# Altium project dory-x.PrjPcb (part 5 of 12)
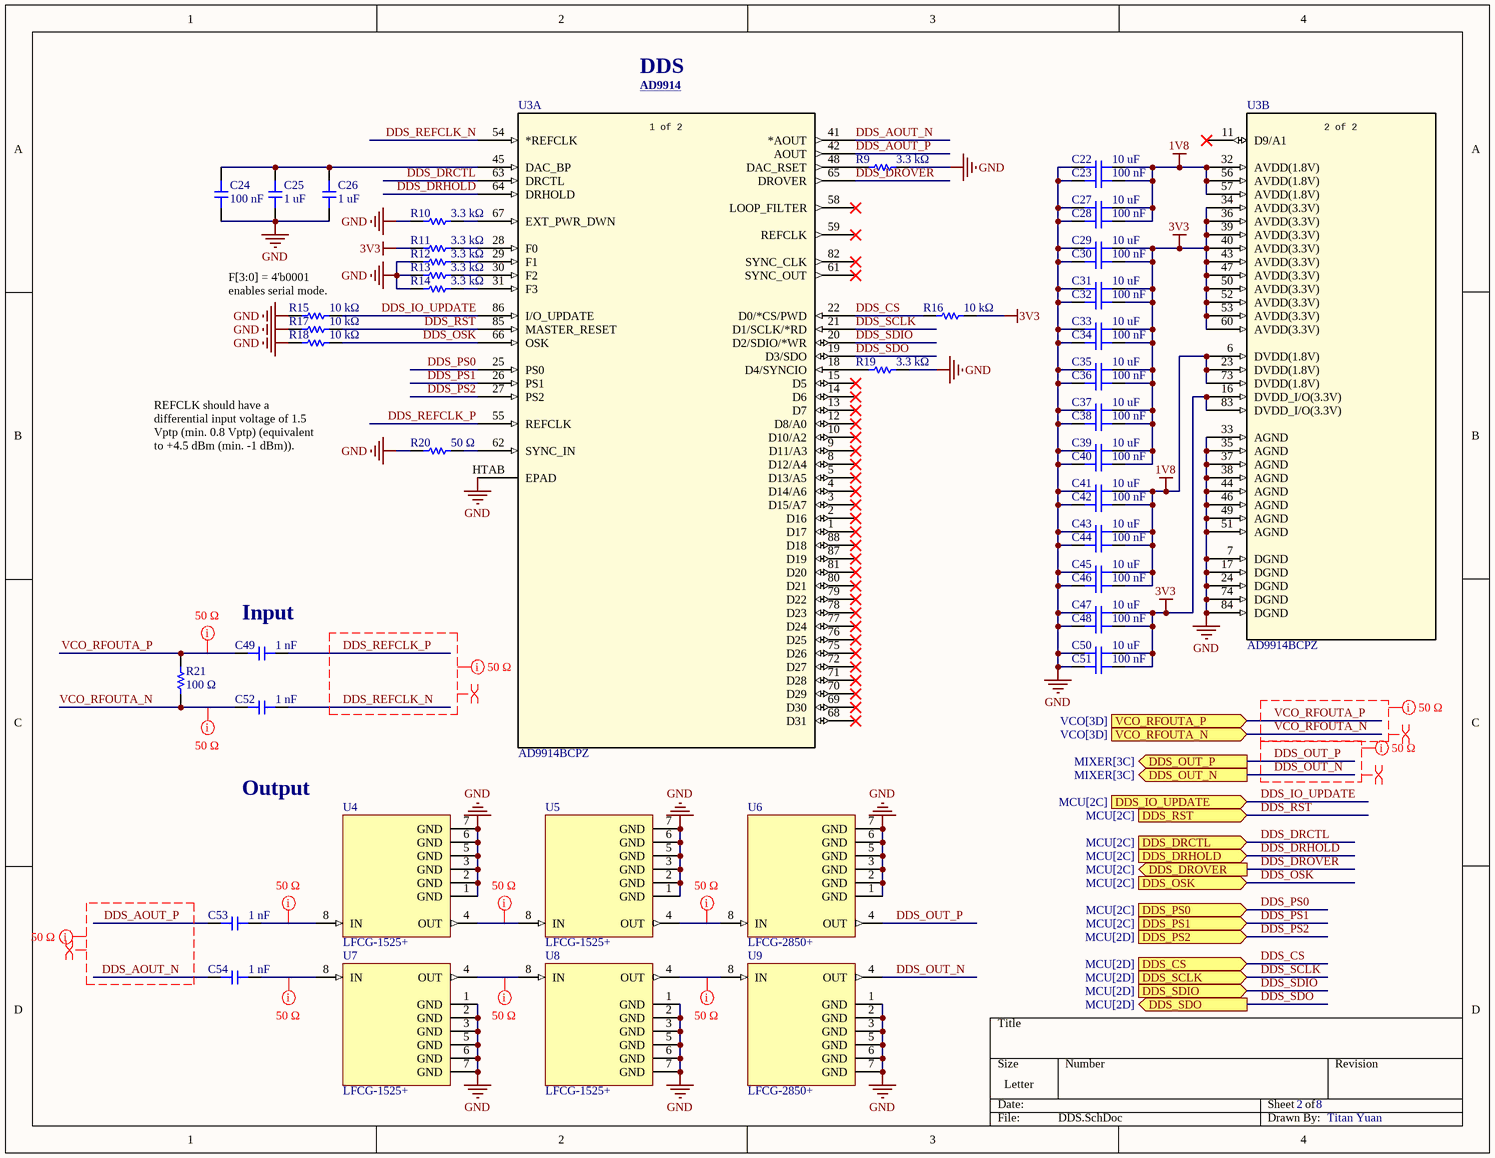
[diagram p11: DDS.SchDoc]

## Sheet DDS.SchDoc (continued)

### Library data of the parts (continued)
U6 U9 = LFCG-2850+: 1.8dB 50Ω 2.85GHz 0805 SMD mount 2mm*1.25mm*950μm; Manufacturer: Mini-Circuits; Cutoff Frequency: 3.25GHz; Manufacturer Part Number: LFCG-2850+; Supplier: DigiKey; Supplier Part Number: 3157-LFCG-2850+CT-ND; RoHS: Compliant; Category: Ceramic Filters; Stock: 1260; Pricing: 1=14.41, 20=7.032, 50=6.744, 100=6.3, 200=5.724, 500=5.136 (USD); Export Control Classification Number (ECCN) Code: EAR99; Height: 950µm; Insertion Loss (dB): 1.8dB; Introduction Date: 2018-10-03; Length: 2mm; Lifecycle Status: Production; Max Operating Temperature: 85°C; Min Operating Temperature: -40°C; Mounting Technology: Surface Mount; REACH SVHC: Yes; Width: 1.25mm; ComponentLink1URL: https://datasheet.octopart.com:443/LFCG-2850%2B-Mini-Circuits-datasheet-180701242.pdf?src-supplier=IHS; ComponentLink1Description: https://datasheet.octopart.com:443/LFCG-2850%2B-Mini-Circuits-datasheet-180701242.pdf?src-supplier=IHS

## Sheet MIXER.SchDoc
size Letter; DrawnBy: Titan Yuan; SheetNumber: 3; SheetTotal: 8
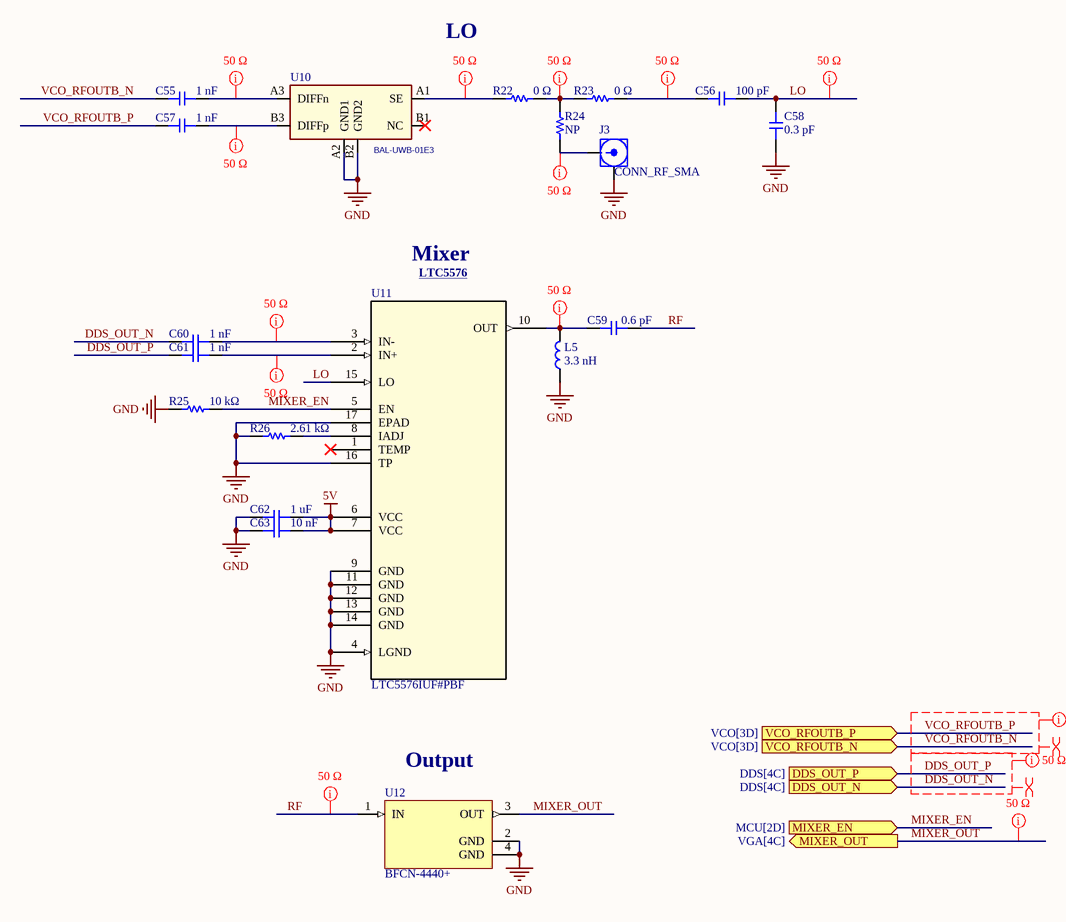
[diagram p2: MIXER.SchDoc]

### Parts
C55  1 nF  [CAP_0402]
C56  100 pF  [CAP_0402]
C57  1 nF  [CAP_0402]
C58  0.3 pF  [CAP_0402]
C59  0.6 pF  [CAP_0402]
C60  1 nF  [CAP_0402]
C61  1 nF  [CAP_0402]
C62  1 uF  [CAP_0603]
C63  10 nF  [CAP_0402]
J3  CONN_RF_SMA  [142-0701-801]
L5  3.3 nH  [IND_0402]
R22  0 Ω  [RES_0402]
R23  0 Ω  [RES_0402]
R24  NP  [RES_0402]
R25  10 kΩ  [RES_0402]
R26  2.61 kΩ  [RES_0402]
U10  BAL-UWB-01E3  [ST_CSP6_82x65P2x3_180x125x45]
U11  LTC5576IUF#PBF  [QFN-16_UF_LIT]
U12  BFCN-4440+  [FV1206]

### Ports
DDS_OUT_N (in, see DDS[4C]), DDS_OUT_P (in, see DDS[4C]), MIXER_EN (in, see MCU[2D]), MIXER_OUT (out, see VGA[4C]), VCO_RFOUTB_N (in, see VCO[3D]), VCO_RFOUTB_P (in, see VCO[3D])

### Nets
5V: C62.2 C63.2 U11.6(VCC) U11.7(VCC)
GND: C58.1 C62.1 C63.1 J3.2 L5.1 R25.1 R26.1 U10.A2(GND1) U10.B2(GND2) U11.4(LGND) U11.9(GND) U11.11(GND) U11.12(GND) U11.13(GND) U11.14(GND) U11.16(TP) U11.17(EPAD) U12.2(GND) U12.4(GND)
DDS_OUT_N: C60.1 ; port DDS_OUT_N
DDS_OUT_P: C61.1 ; port DDS_OUT_P
LO: C56.2 C58.2 U11.15(LO)  [project net LO_3]
MIXER_EN: R25.2 U11.5(EN) ; port MIXER_EN
MIXER_OUT: U12.3(OUT) ; port MIXER_OUT
RF: C59.2 U12.1(IN)  [project net RF_3]
VCO_RFOUTB_N: C55.2 ; port VCO_RFOUTB_N
VCO_RFOUTB_P: C57.2 ; port VCO_RFOUTB_P
NetC55_1: C55.1 U10.A3(DIFFn)
NetC56_1: C56.1 R23.2
NetC57_1: C57.1 U10.B3(DIFFp)
NetC59_1: C59.1 L5.2 U11.10(OUT)
NetC60_2: C60.2 U11.3(IN-)
NetC61_2: C61.2 U11.2(IN+)
NetJ3_1: J3.1 R24.1
NetR22_1: R22.1 U10.A1(SE)
NetR22_2: R22.2 R23.1 R24.2
NetR26_2: R26.2 U11.8(IADJ)

Not connected (* = marked no-connect by the designer): U10 B1(NC)*; U11 1(TEMP)*

### Layout directives
differential pair: DDS_OUT_N, DDS_OUT_P, VCO_RFOUTB_N, VCO_RFOUTB_P
net class 50 Ω: DDS_OUT_N, DDS_OUT_P, LO_3, MIXER_OUT, NetC55_1, NetC56_1, NetC57_1, NetC59_1, NetC60_2, NetC61_2, NetJ3_1, NetR22_1, NetR22_2, RF_3, VCO_RFOUTB_N, VCO_RFOUTB_P

### Notes on the sheet
- LO
- Mixer
- (near U11) LTC5576 <https://www.analog.com/en/products/ltc5576.html>
- (near U12) Output